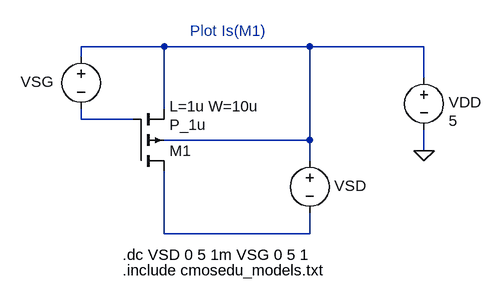
[diagram p0: schematic Fig10_5_PMOS.asc]
Fig10_5_PMOS.asc, the LTspice schematic file:
Version 4
SHEET 1 1224 688
WIRE 448 16 320 16
WIRE 672 16 448 16
WIRE 848 16 672 16
WIRE 320 32 320 16
WIRE 848 64 848 16
WIRE 448 112 448 16
WIRE 320 128 320 112
WIRE 400 128 320 128
WIRE 672 160 672 16
WIRE 672 160 448 160
WIRE 848 176 848 144
WIRE 672 192 672 160
WIRE 448 304 448 208
WIRE 672 304 672 272
WIRE 672 304 448 304
FLAG 848 176 0
SYMBOL voltage 320 16 R0
WINDOW 0 -93 54 Left 2
WINDOW 3 24 104 Invisible 2
SYMATTR InstName VSG
SYMATTR Value 0
SYMBOL voltage 672 176 R0
WINDOW 123 0 0 Left 2
WINDOW 39 0 0 Left 2
WINDOW 0 38 54 Left 2
WINDOW 3 24 104 Invisible 2
SYMATTR InstName VSD
SYMATTR Value 0
SYMBOL pmos4 400 208 M180
WINDOW 123 56 100 Left 2
SYMATTR Value2 L=1u W=10u
SYMATTR InstName M1
SYMATTR Value P_1u
SYMBOL voltage 848 48 R0
WINDOW 123 0 0 Left 2
WINDOW 39 0 0 Left 2
WINDOW 0 38 54 Left 2
WINDOW 3 38 82 Left 2
SYMATTR InstName VDD
SYMATTR Value 5
TEXT 384 336 Left 2 !.dc VSD 0 5 1m VSG 0 5 1
TEXT 384 360 Left 2 !.include cmosedu_models.txt
TEXT 488 -8 Left 2 ;Plot Is(M1)

The netlist it stands for:
* Fig10_5_PMOS.asc
VSG N001 N002 0
VSD N001 N003 0
M1 N003 N002 N001 N001 P_1u L=1u W=10u
VDD N001 0 5
.model NMOS NMOS
.model PMOS PMOS
.lib standard.mos
.dc VSD 0 5 1m VSG 0 5 1
.include cmosedu_models.txt
* Plot Is(M1)
.backanno
.end